# EAGLE schematic self-balan (EAGLE 9.3.0)
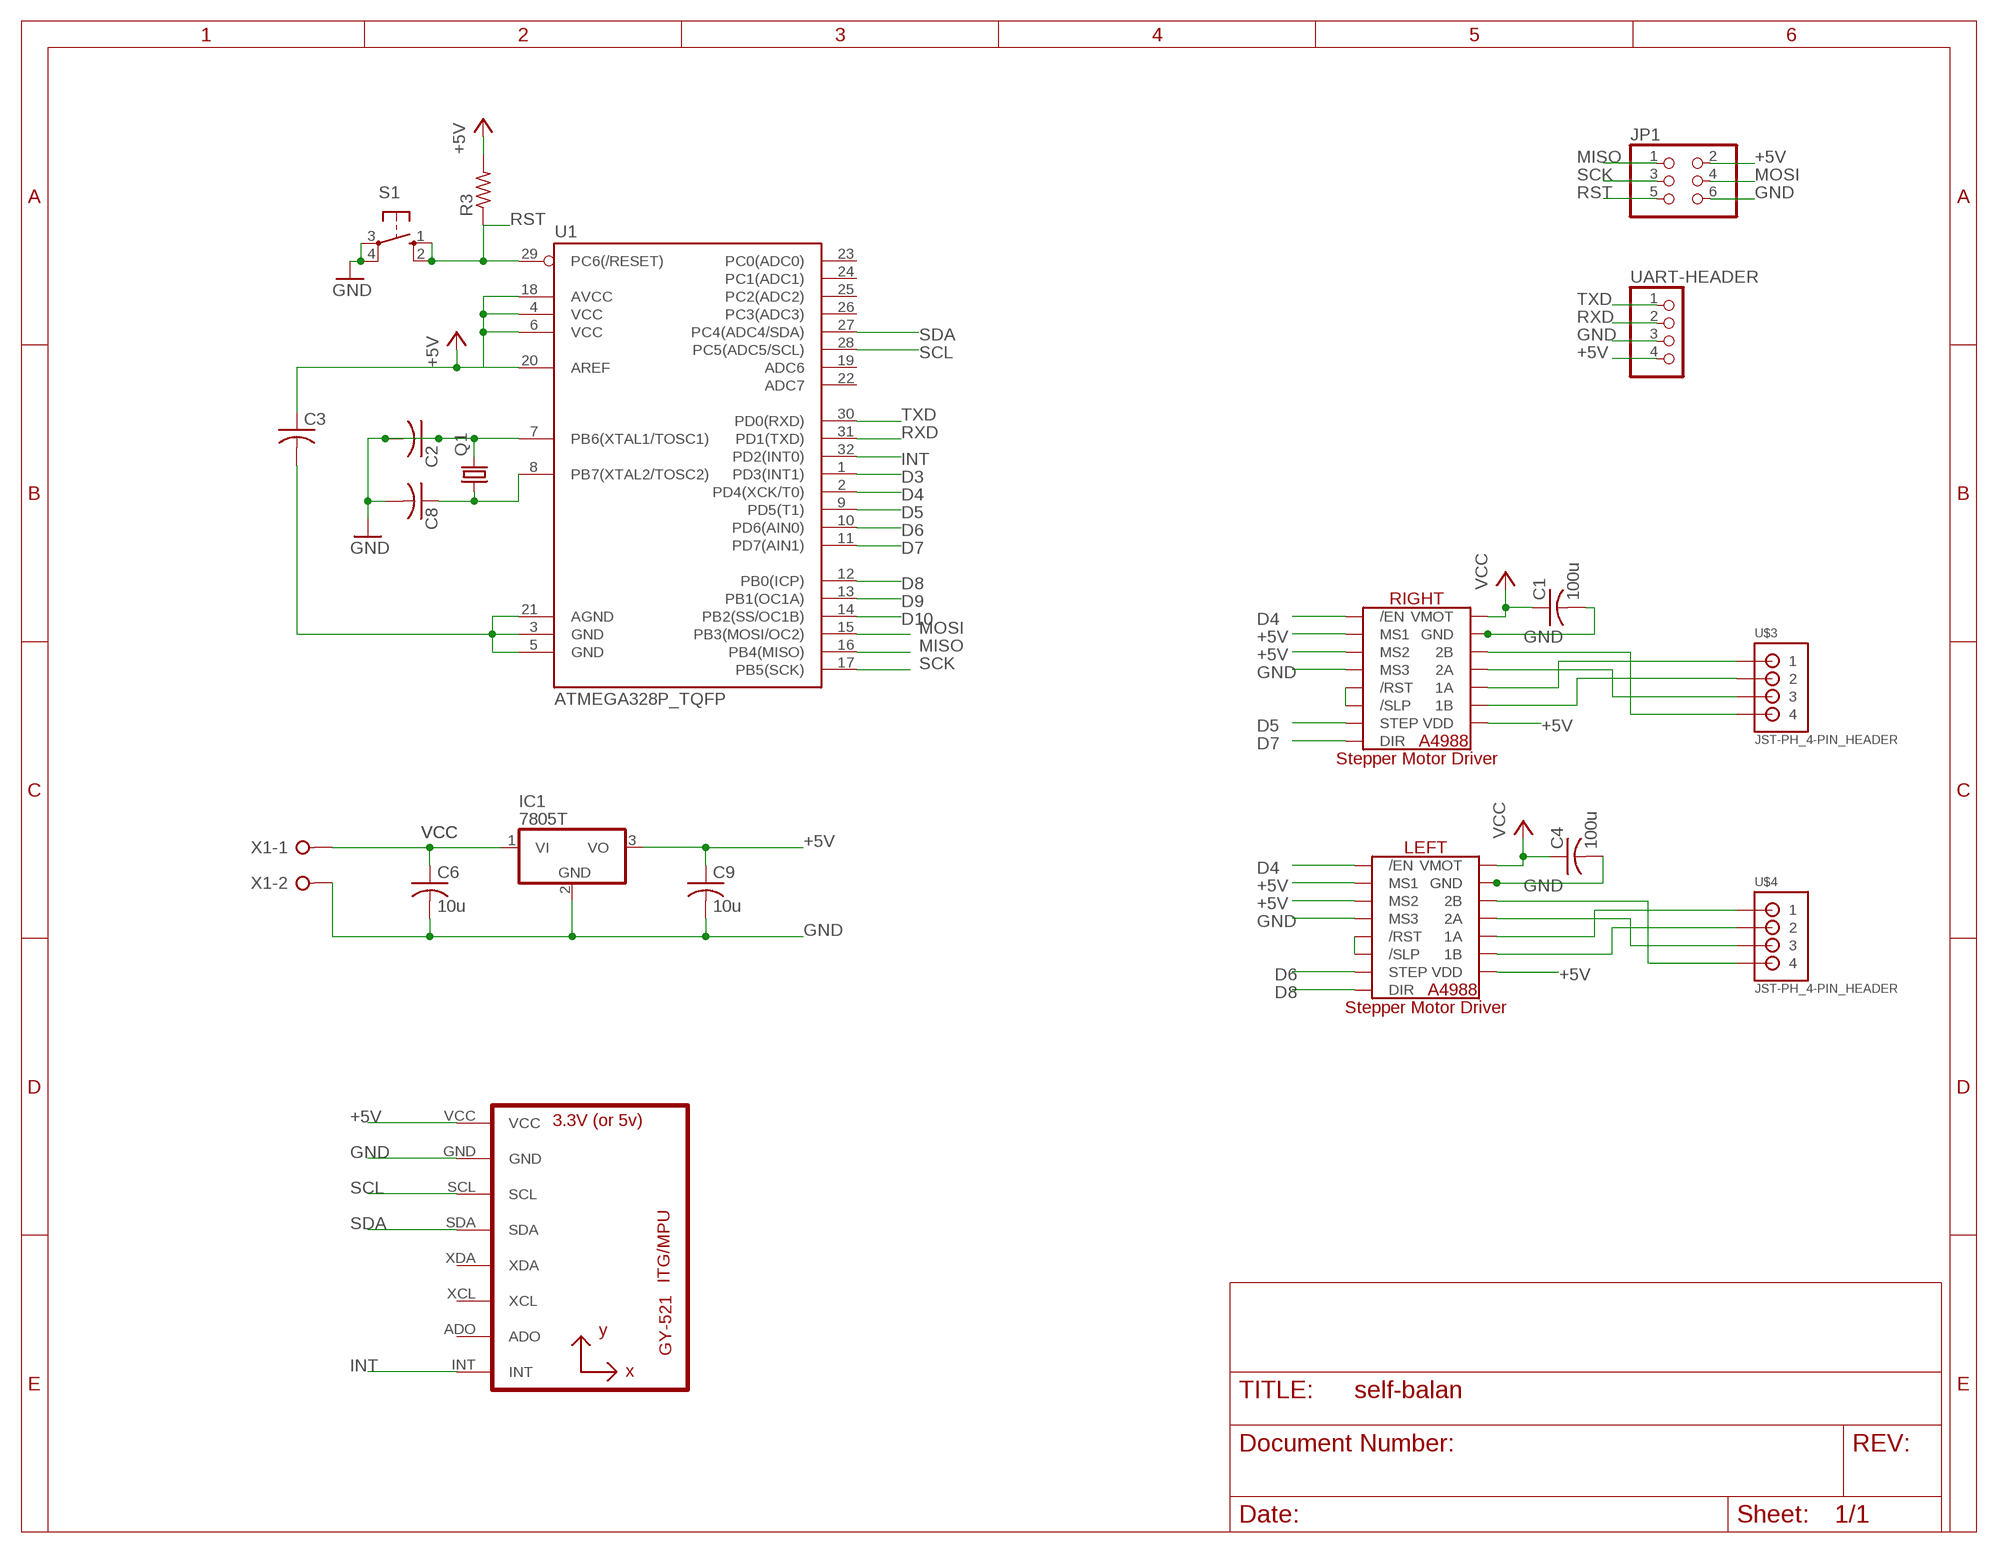
[diagram p0: schematic, sheet 1]

## Parts
C1  100u  C-USC0805  [C0805]
C2  C-USC0805  [C0805]
C3  C-USC0805  [C0805]
C4  100u  C-USC0805  [C0805]
C6  10u  C-USC0805  [C0805]
C8  C-USC0805  [C0805]
C9  10u  C-USC0805  [C0805]
IC1  7805T  [TO220H]
JP1  PINHD-2X3  [2X03]
LEFT  A4988_STEP  [A4988_STEP]
Q1  CRYSTALHC18U-V  [HC18U-V]
R3  R-US_R0805  [R0805]
RIGHT  A4988_STEP  [A4988_STEP]
S1  10-XX  [B3F-10XX]
U1  ATMEGA328P_TQFP  [TQFP32-08]
U2  GY-521MPU6050  [GY-521]
U$3  JST-PH_4-PIN_HEADER  [JST_B4B-PH_HEADER]
U$4  JST-PH_4-PIN_HEADER  [JST_B4B-PH_HEADER]
UART-HEADER  PINHD-1X4  [1X04]
X1  W237-02P  [W237-132]

## Nets
+5V: C3.1 C9.1 IC1.3(VO) JP1.2 LEFT.MS1 LEFT.MS2 LEFT.VDD R3.2 RIGHT.MS1 RIGHT.MS2 RIGHT.VDD U1.4(VCC) U1.6(VCC) U1.18(AVCC) U1.20(AREF) U2.VCC UART-HEADER.4
D3: U1.1(PD3(INT1))
D4: LEFT./EN RIGHT./EN U1.2(PD4(XCK/T0))
D5: RIGHT.STEP U1.9(PD5(T1))
D6: LEFT.STEP U1.10(PD6(AIN0))
D7: RIGHT.DIR U1.11(PD7(AIN1))
D8: LEFT.DIR U1.12(PB0(ICP))
D9: U1.13(PB1(OC1A))
D10: U1.14(PB2(SS/OC1B))
GND: C1.2 C2.1 C2.2 C4.2 C6.2 C8.2 C9.2 IC1.2(GND) JP1.6 LEFT.GND LEFT.GND2(GND) LEFT.MS3 Q1.2 RIGHT.GND RIGHT.GND2(GND) RIGHT.MS3 S1.3(P) S1.4(P1) U1.7(PB6(XTAL1/TOSC1)) U2.GND UART-HEADER.3 X1.2
INT: U1.32(PD2(INT0)) U2.INT
MISO: JP1.1 U1.16(PB4(MISO))
MOSI: JP1.4 U1.15(PB3(MOSI/OC2))
N$3: C3.2 U1.3(GND) U1.5(GND) U1.21(AGND)
N$4: C8.1 Q1.1 U1.8(PB7(XTAL2/TOSC2))
N$7: RIGHT.2B U$3.P4
N$8: RIGHT.2A U$3.P3
N$9: RIGHT.1B U$3.P2
N$10: RIGHT.1A U$3.P1
N$11: LEFT.2B U$4.P4
N$12: LEFT.2A U$4.P3
N$13: RIGHT./RST RIGHT./SLP
N$14: LEFT.1B U$4.P2
N$15: LEFT.1A U$4.P1
N$16: LEFT./RST LEFT./SLP
RST: JP1.5 R3.1 S1.1(S) S1.2(S1) U1.29(PC6(/RESET))
RXD: U1.31(PD1(TXD)) UART-HEADER.2
SCK: JP1.3 U1.17(PB5(SCK))
SCL: U1.28(PC5(ADC5/SCL)) U2.SCL
SDA: U1.27(PC4(ADC4/SDA)) U2.SDA
TXD: U1.30(PD0(RXD)) UART-HEADER.1
VCC: C1.1 C4.1 C6.1 IC1.1(VI) LEFT.VMOT RIGHT.VMOT X1.1
Unconnected: U1.19(ADC6) U1.22(ADC7) U1.23(PC0(ADC0)) U1.24(PC1(ADC1)) U1.25(PC2(ADC2)) U1.26(PC3(ADC3)) U2.ADO U2.XCL U2.XDA

## Library data of the parts
C1-C4 C6 C8 C9 = rcl:C-US: CAPACITOR, American symbol; SPICEPREFIX: C
IC1 = linear:78*: Positive VOLTAGE REGULATOR Source: http://cache.national.com/ds/LM/LM78L05.pdf http://www.fairchildsemi.com/ds/LM/LM7805.pdf
JP1 = pinhead:PINHD-2X3: PIN HEADER
LEFT RIGHT = IC:A4988_STEP
Q1 = adafruit:CRYSTAL: CRYSTAL; OC_FARNELL: unknown; OC_NEWARK: unknown
R3 = rcl:R-US_: RESISTOR, American symbol; SPICEPREFIX: R
S1 = switch-omron:10-XX: OMRON SWITCH; MPN: B3F-1000; OC_FARNELL: 176432; OC_NEWARK: 36M3542
U1 = SparkFun-IC-Microcontroller:ATMEGA328P_TQFP: Popular 328P in QFP Storefront component: ATmega328 - TQFP <https://www.sparkfun.com/products/13448> (COM-13448) Datasheet <http://www.sparkfun.com/datasheets/Components/SMD/ATMega328.pdf> SparkFun Products SparkFun RedBoard - Programmed with Arduino <https://www.sparkfun.com/products/12757> (DEV-12757) Arduino Pro Mini 328 - 5V/16MHz <https://www.sparkfun.com/products/11113> (DEV-11113) Arduino Pro Mini 328 - 3.3V/8MHz <https://www.sparkfun.com/products/11114> (DEV-11114) SparkFun OpenLog <https://www.sparkfun.com/products/13712> (DEV-13712) SparkFun MicroView - OLED Arduino Module <https://www.sparkfun.com/products/12923> (DEV-12923) SparkFun Digital Sandbox <https://www.sparkfun.com/products/12651> (DEV-12651) SparkFun PicoBoard <https://www.sparkfun.com/products/11888> (WIG-11888) Arduino Fio <https://www.sparkfun.com/products/10116> (DEV-10116) LilyPad Arduino 328 Main Board <https://www.sparkfun.com/products/13342> (DEV-13342) SparkFun RedStick <https://www.sparkfun.com/products/13741> (DEV-13741) LilyPad MP3 <https://www.sparkfun.com/products/11013> (DEV-11013) LilyPad Arduino SimpleSnap <https://www.sparkfun.com/products/10941> (DEV-10941) SparkFun Stepoko <https://www.sparkfun.com/products/13899> (ROB-13899) SparkFun Geiger Counter <https://www.sparkfun.com/products/11345> (SEN-11345) SparkFun EL Sequencer <https://www.sparkfun.com/products/12781> (COM-12781) Arduino Pro 328 - 5V/16MHz <https://www.sparkfun.com/products/10915> (DEV-10915) CryptoCape <https://www.sparkfun.com/products/12773> (DEV-12773) SparkFun IR Thermometer Evaluation Board - MLX90614 <https://www.sparkfun.com/products/10740> (SEN-10740) SparkFun RedBot Mainboard <https://www.sparkfun.com/products/12097> (ROB-12097) Arduino Pro 328 - 3.3V/8MHz <https://www.sparkfun.com/products/10914> (DEV-10914) SparkFun Block for Intel® Edison - Arduino <https://www.sparkfun.com/products/13036> (DEV-13036) SparkFun Simon Says - Surface Mount Soldering Kit <https://www.sparkfun.com/products/10935> (KIT-10935) SparkFun 7-Segment Serial Display - Red <https://www.sparkfun.com/products/11441> (COM-11441) SparkFun 7-Segment Serial Display - White <https://www.sparkfun.com/products/11629> (COM-11629) SparkFun 7-Segment Serial Display - Yellow <https://www.sparkfun.com/products/11443> (COM-11443) SparkFun 7-Segment Serial Display - Kelly Green <https://www.sparkfun.com/products/11440> (COM-11440) SparkFun 7-Segment Serial Display - Blue <https://www.sparkfun.com/products/11442> (COM-11442) SparkFun OpenSegment Serial Display - 20mm (Blue) <https://www.sparkfun.com/products/11647> (COM-11647) SparkFun OpenSegment Serial Display - 20mm (Green) <https://www.sparkfun.com/products/11646> (COM-11646) SparkFun OpenSegment Serial Display - 20mm (White) <https://www.sparkfun.com/products/11648> (COM-11648) SparkFun OpenSegment Serial Display - 20mm (Red) <https://www.sparkfun.com/products/11644> (COM-11644) SparkFun OpenSegment Serial Display - 20mm (Yellow) <https://www.sparkfun.com/products/11645> (COM-11645) SparkFun OpenSegment Shield <https://www.sparkfun.com/products/13190> (DEV-13190); PROD_ID: IC-09069
U2 = gy-521:GY-521
U$3 U$4 = SRG:JST-PH_4-PIN_HEADER: 4-pin JST PH Shrouded Header, top entry P/N B4B-PH-K-S Mating connector PHR-4 Mating cable assembly: Sparkfun PRT-09916 <http://www.sparkfun.com/products/9916>
UART-HEADER = pinhead:PINHD-1X4: PIN HEADER
X1 = con-wago-508:W237-02P: WAGO SREW CLAMP; OC_FARNELL: unknown; OC_NEWARK: unknown